# Altium project bms_mainboard-1_0.PrjPcb (part 2 of 7)

## Sheet mcu_stm32f4.SchDoc
size D; SheetNumber: 2
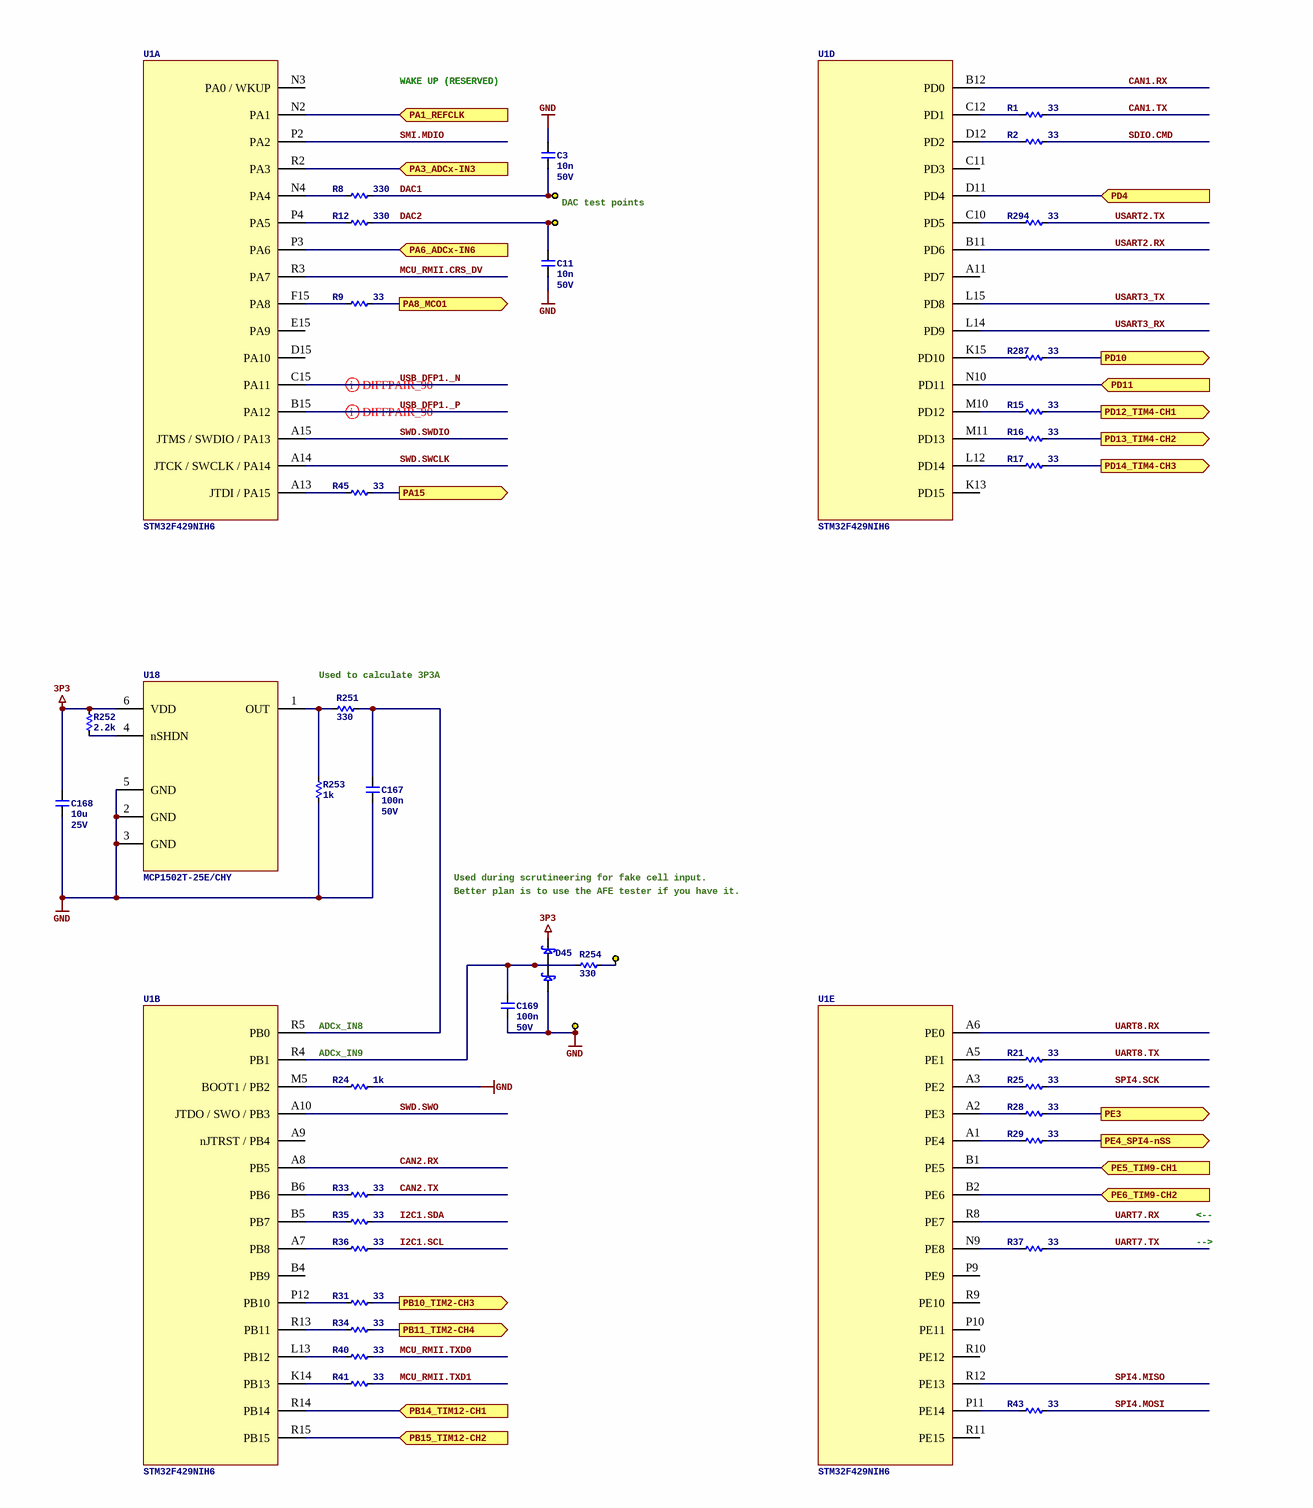
[diagram p4: mcu_stm32f4.SchDoc, top left]
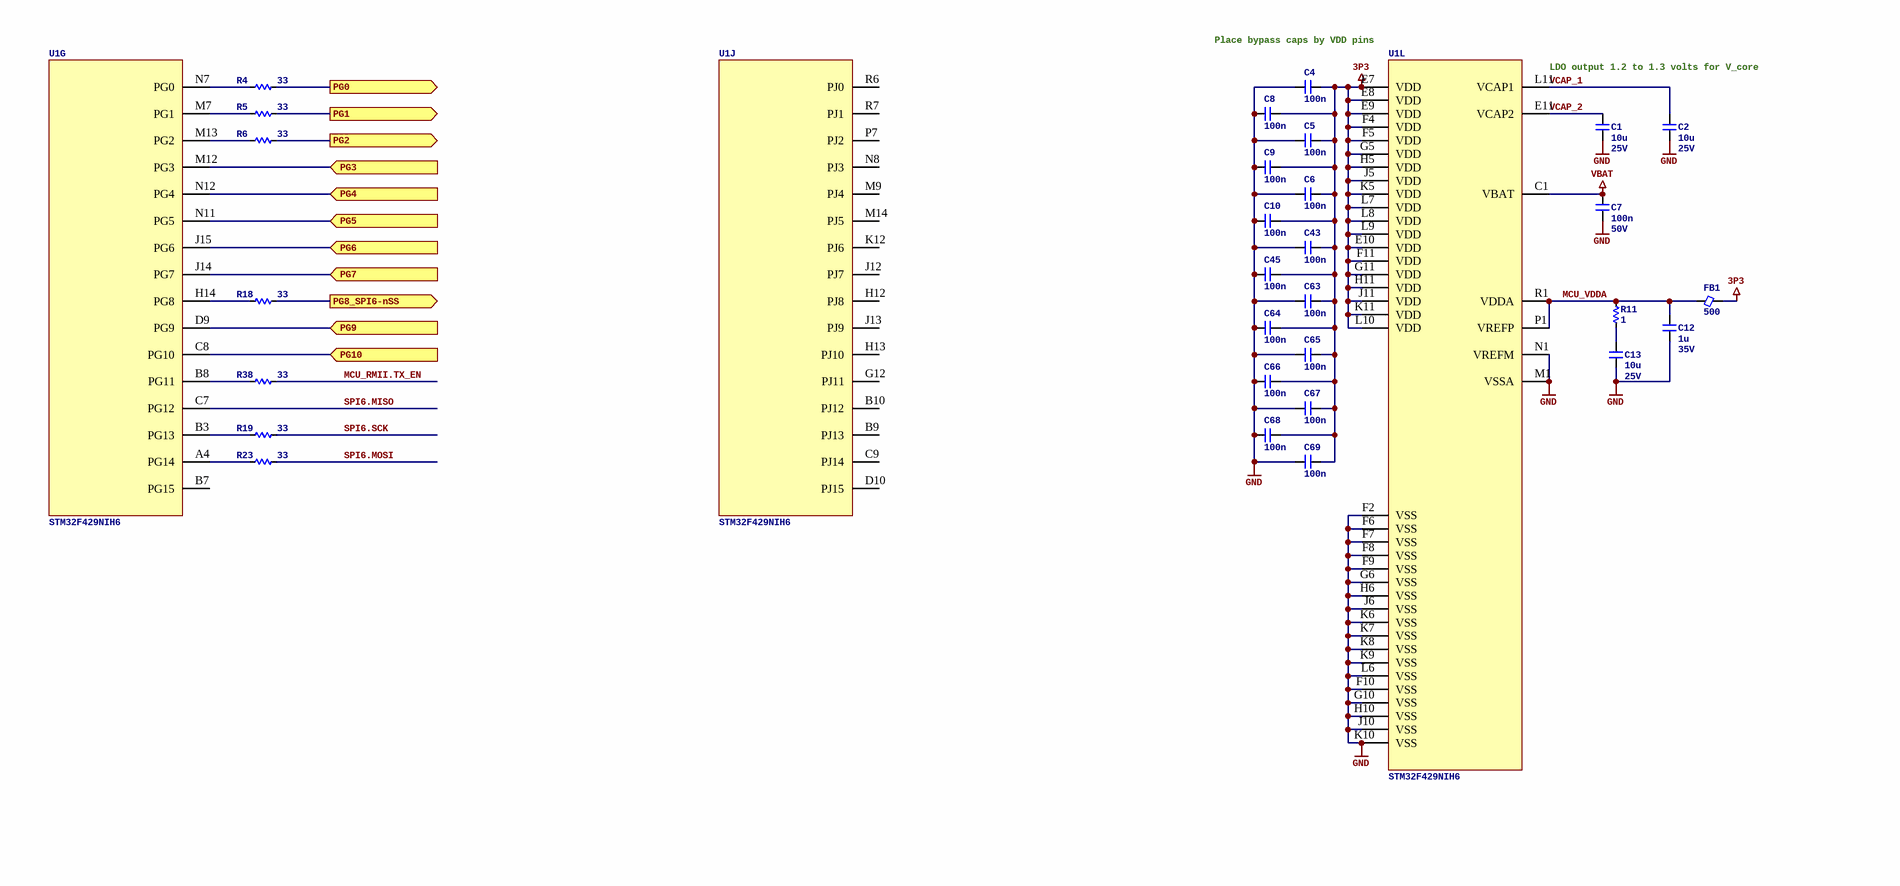
[diagram p5: mcu_stm32f4.SchDoc, top right]
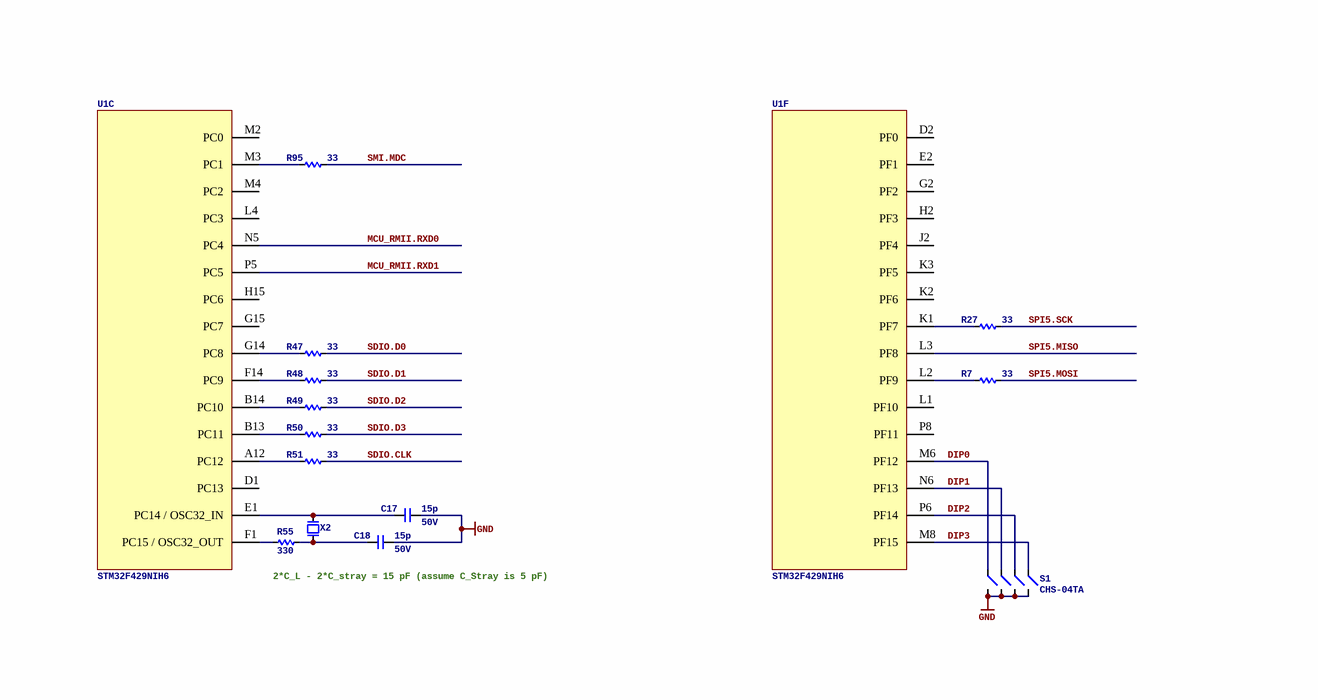
[diagram p6: mcu_stm32f4.SchDoc, bottom left]
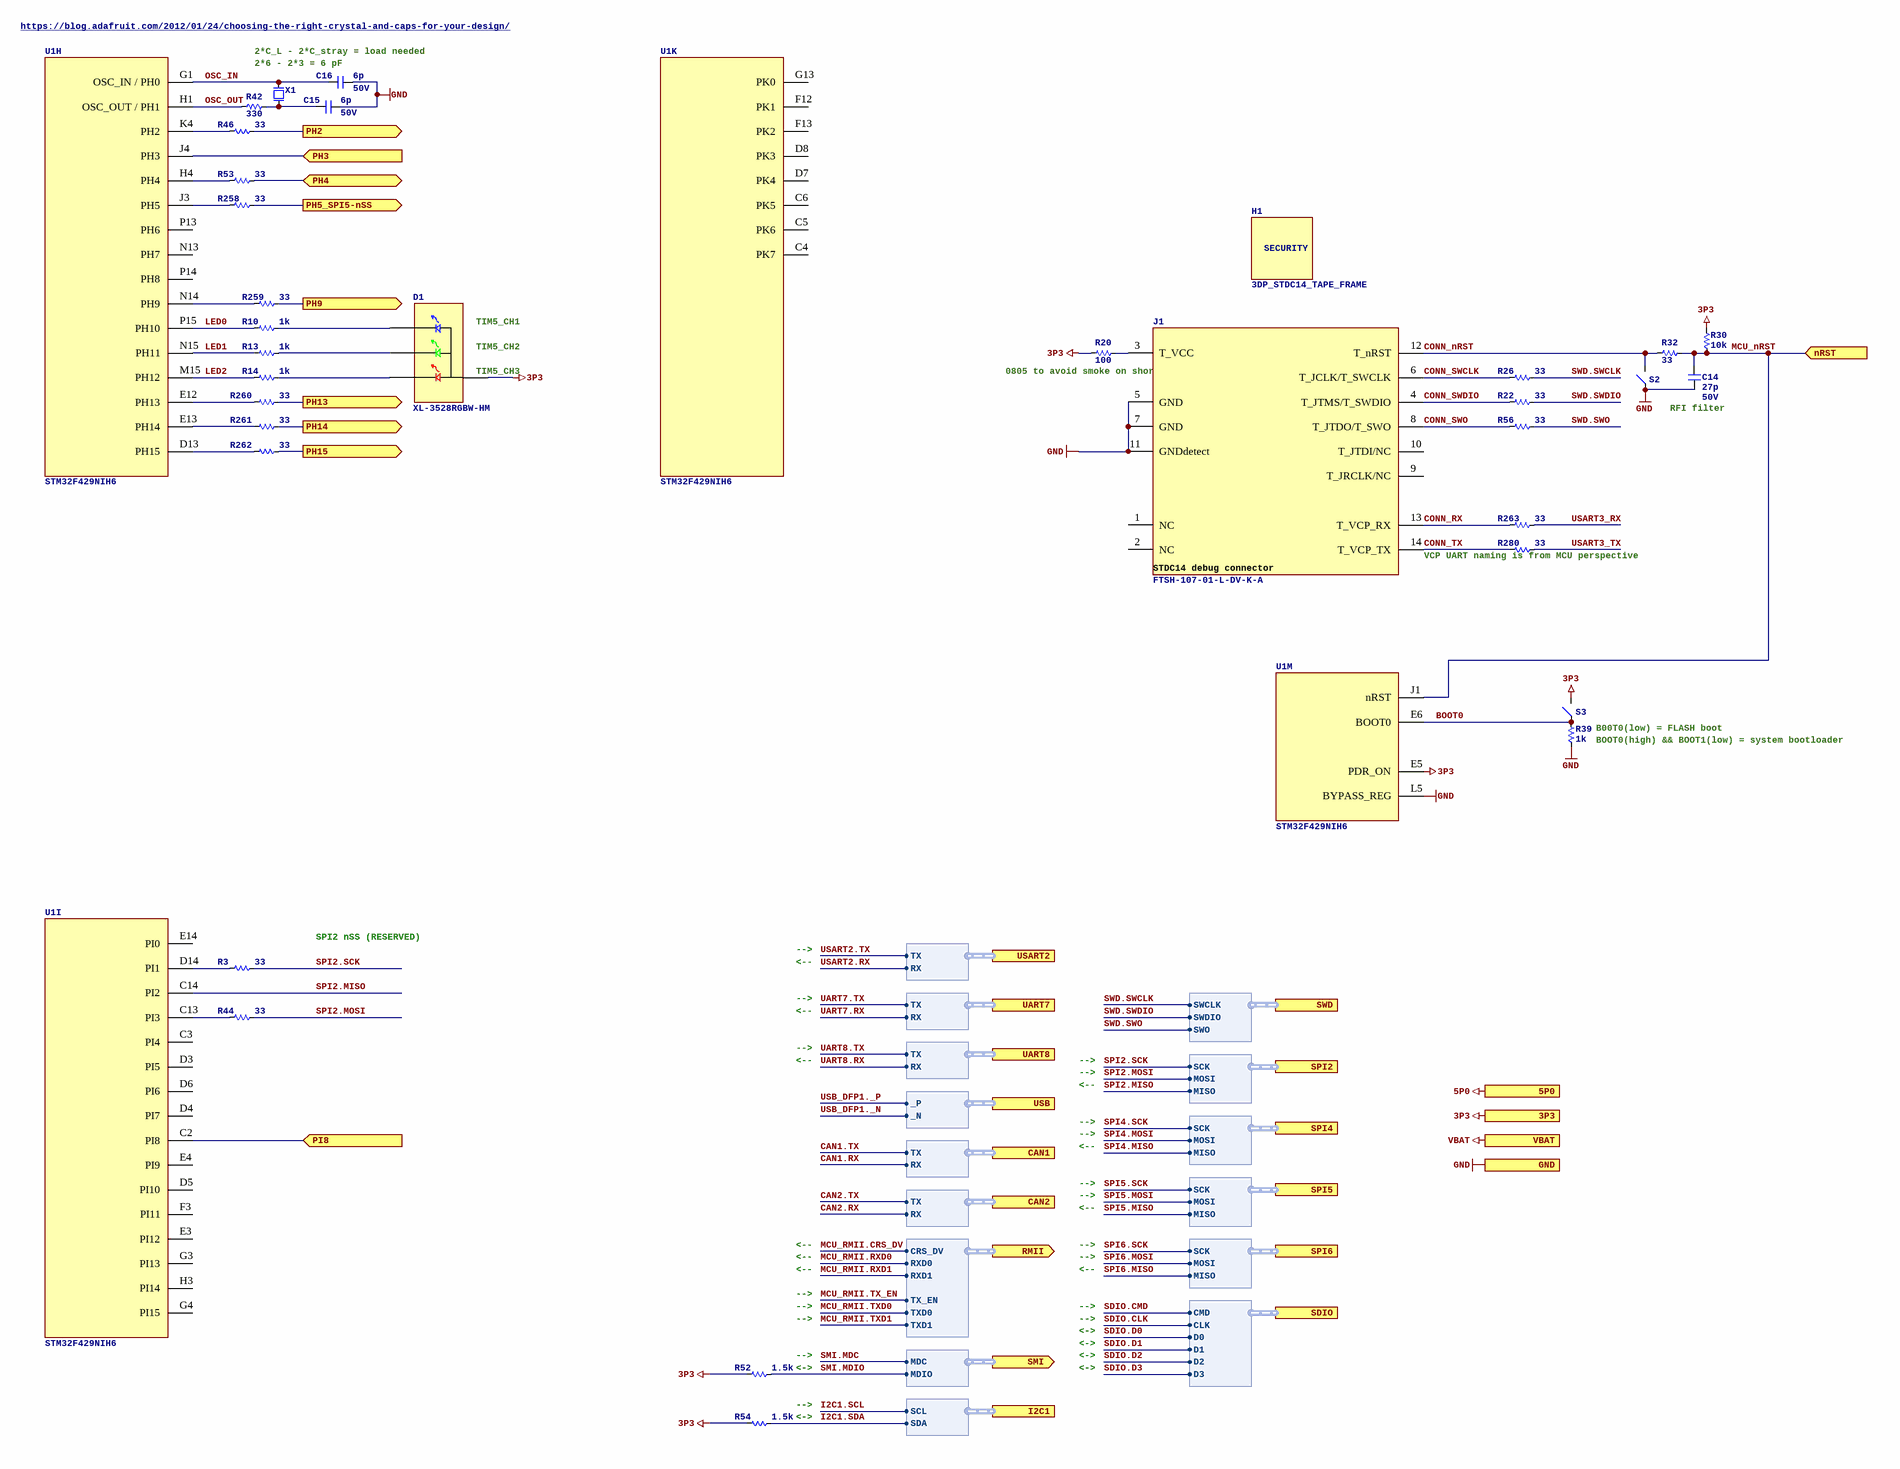
[diagram p7: mcu_stm32f4.SchDoc, bottom right]

### Parts
C1  Capacitance: 10u  Voltage Rating: 25V  [C0603]  (hidden comment: CL10A106MA8NRNC)
C2  Capacitance: 10u  Voltage Rating: 25V  [C0603]  (hidden comment: CL10A106MA8NRNC)
C3  Capacitance: 10n  Voltage Rating: 50V  [C0402]  (hidden comment: CL05B103KB5NNNC)
C4  Capacitance: 100n  [C0402]  (hidden comment: CL05B104KB54PNC)
C5  Capacitance: 100n  [C0402]  (hidden comment: CL05B104KB54PNC)
C6  Capacitance: 100n  [C0402]  (hidden comment: CL05B104KB54PNC)
C7  Capacitance: 100n  Voltage Rating: 50V  [C0402]  (hidden comment: CL05B104KB54PNC)
C8  Capacitance: 100n  [C0402]  (hidden comment: CL05B104KB54PNC)
C9  Capacitance: 100n  [C0402]  (hidden comment: CL05B104KB54PNC)
C10  Capacitance: 100n  [C0402]  (hidden comment: CL05B104KB54PNC)
C11  Capacitance: 10n  Voltage Rating: 50V  [C0402]  (hidden comment: CL05B103KB5NNNC)
C12  Capacitance: 1u  Voltage Rating: 35V  [C0603]  (hidden comment: GMK107AB7105KAHT)
C13  Capacitance: 10u  Voltage Rating: 25V  [C0805]  (hidden comment: CL21B106KAYQNNE)
C14  Capacitance: 27p  Voltage Rating: 50V  [C0402]  (hidden comment: 0402CG270J500NT)
C15  Capacitance: 6p  Voltage Rating: 50V  [C0402]  (hidden comment: 0402CG6R0C500NT)
C16  Capacitance: 6p  Voltage Rating: 50V  [C0402]  (hidden comment: 0402CG6R0C500NT)
C17  Capacitance: 15p  Voltage Rating: 50V  [C0402]  (hidden comment: 0402CG150J500NT)
C18  Capacitance: 15p  Voltage Rating: 50V  [C0402]  (hidden comment: 0402CG150J500NT)
C43  Capacitance: 100n  [C0402]  (hidden comment: CL05B104KB54PNC)
C45  Capacitance: 100n  [C0402]  (hidden comment: CL05B104KB54PNC)
C63  Capacitance: 100n  [C0402]  (hidden comment: CL05B104KB54PNC)
C64  Capacitance: 100n  [C0402]  (hidden comment: CL05B104KB54PNC)
C65  Capacitance: 100n  [C0402]  (hidden comment: CL05B104KB54PNC)
C66  Capacitance: 100n  [C0402]  (hidden comment: CL05B104KB54PNC)
C67  Capacitance: 100n  [C0402]  (hidden comment: CL05B104KB54PNC)
C68  Capacitance: 100n  [C0402]  (hidden comment: CL05B104KB54PNC)
C69  Capacitance: 100n  [C0402]  (hidden comment: CL05B104KB54PNC)
C167  Capacitance: 100n  Voltage Rating: 50V  [C0402]  (hidden comment: CL05B104KB54PNC)
C168  Capacitance: 10u  Voltage Rating: 25V  [C0603]  (hidden comment: CL10A106MA8NRNC)
C169  Capacitance: 100n  Voltage Rating: 50V  [C0402]  (hidden comment: CL05B104KB54PNC)
D1  XL-3528RGBW-HM  [LED_RGB_SMD3528-4P]
D45  BAT54SLT1G  [3SOT23]  (value not drawn)
FB1  Current Rating (mA): 500  [FB0402]  (hidden comment: BLM15AX601SN1D)
H1  3DP_STDC14_TAPE_FRAME  [3DP_STDC14_TAPE_FRAME]
J1  FTSH-107-01-L-DV-K-A  [SAMTEC_FTSH-107-01-L-DV-K-A]
R1  value 33  [R0402]  (hidden comment: 0402WGF330JTCE)
R2  value 33  [R0402]  (hidden comment: 0402WGF330JTCE)
R3  value 33  [R0402]  (hidden comment: 0402WGF330JTCE)
R4  value 33  [R0402]  (hidden comment: 0402WGF330JTCE)
R5  value 33  [R0402]  (hidden comment: 0402WGF330JTCE)
R6  value 33  [R0402]  (hidden comment: 0402WGF330JTCE)
R7  value 33  [R0402]  (hidden comment: 0402WGF330JTCE)
R8  value 330  [R0402]  (hidden comment: 0402WGF3300TCE)
R9  value 33  [R0402]  (hidden comment: 0402WGF330JTCE)
R10  value 1k  [R0402]  (hidden comment: 0402WGF1001TCE)
R11  value 1  [R0402]  (hidden comment: CRCW04021R00FKED)
R12  value 330  [R0402]  (hidden comment: 0402WGF3300TCE)
R13  value 1k  [R0402]  (hidden comment: 0402WGF1001TCE)
R14  value 1k  [R0402]  (hidden comment: 0402WGF1001TCE)
R15  value 33  [R0402]  (hidden comment: 0402WGF330JTCE)
R16  value 33  [R0402]  (hidden comment: 0402WGF330JTCE)
R17  value 33  [R0402]  (hidden comment: 0402WGF330JTCE)
R18  value 33  [R0402]  (hidden comment: 0402WGF330JTCE)
R19  value 33  [R0402]  (hidden comment: 0402WGF330JTCE)
R20  value 100  [R0805]  (hidden comment: ERJP06F1000V)
R21  value 33  [R0402]  (hidden comment: 0402WGF330JTCE)
R22  value 33  [R0402]  (hidden comment: 0402WGF330JTCE)
R23  value 33  [R0402]  (hidden comment: 0402WGF330JTCE)
R24  value 1k  [R0402]  (hidden comment: 0402WGF1001TCE)
R25  value 33  [R0402]  (hidden comment: 0402WGF330JTCE)
R26  value 33  [R0402]  (hidden comment: 0402WGF330JTCE)
R27  value 33  [R0402]  (hidden comment: 0402WGF330JTCE)
R28  value 33  [R0402]  (hidden comment: 0402WGF330JTCE)
R29  value 33  [R0402]  (hidden comment: 0402WGF330JTCE)
R30  value 10k  [R0402]  (hidden comment: 0402WGF1002TCE)
R31  value 33  [R0402]  (hidden comment: 0402WGF330JTCE)
R32  value 33  [R0402]  (hidden comment: 0402WGF330JTCE)
R33  value 33  [R0402]  (hidden comment: 0402WGF330JTCE)
R34  value 33  [R0402]  (hidden comment: 0402WGF330JTCE)
R35  value 33  [R0402]  (hidden comment: 0402WGF330JTCE)
R36  value 33  [R0402]  (hidden comment: 0402WGF330JTCE)
R37  value 33  [R0402]  (hidden comment: 0402WGF330JTCE)
R38  value 33  [R0402]  (hidden comment: 0402WGF330JTCE)
R39  value 1k  [R0402]  (hidden comment: 0402WGF1001TCE)
R40  value 33  [R0402]  (hidden comment: 0402WGF330JTCE)
R41  value 33  [R0402]  (hidden comment: 0402WGF330JTCE)
R42  value 330  [R0402]  (hidden comment: 0402WGF3300TCE)
R43  value 33  [R0402]  (hidden comment: 0402WGF330JTCE)
R44  value 33  [R0402]  (hidden comment: 0402WGF330JTCE)
R45  value 33  [R0402]  (hidden comment: 0402WGF330JTCE)
R46  value 33  [R0402]  (hidden comment: 0402WGF330JTCE)
R47  value 33  [R0402]  (hidden comment: 0402WGF330JTCE)
R48  value 33  [R0402]  (hidden comment: 0402WGF330JTCE)
R49  value 33  [R0402]  (hidden comment: 0402WGF330JTCE)
R50  value 33  [R0402]  (hidden comment: 0402WGF330JTCE)
R51  value 33  [R0402]  (hidden comment: 0402WGF330JTCE)
R52  value 1.5k  [R0402]  (hidden comment: 0402WGF1501TCE)
R53  value 33  [R0402]  (hidden comment: 0402WGF330JTCE)
R54  value 1.5k  [R0402]  (hidden comment: 0402WGF1501TCE)
R55  value 330  [R0402]  (hidden comment: 0402WGF3300TCE)
R56  value 33  [R0402]  (hidden comment: 0402WGF330JTCE)
R95  value 33  [R0402]  (hidden comment: 0402WGF330JTCE)
R251  value 330  [R0402]  (hidden comment: 0402WGF3300TCE)
R252  value 2.2k  [R0402]  (hidden comment: 0402WGF2201TCE)
R253  value 1k  [R0402]  (hidden comment: 0402WGF1001TCE)
R254  value 330  [R0402]  (hidden comment: 0402WGF3300TCE)
R258  value 33  [R0402]  (hidden comment: 0402WGF330JTCE)
R259  value 33  [R0402]  (hidden comment: 0402WGF330JTCE)
R260  value 33  [R0402]  (hidden comment: 0402WGF330JTCE)
R261  value 33  [R0402]  (hidden comment: 0402WGF330JTCE)
R262  value 33  [R0402]  (hidden comment: 0402WGF330JTCE)
R263  value 33  [R0402]  (hidden comment: 0402WGF330JTCE)
R280  value 33  [R0402]  (hidden comment: 0402WGF330JTCE)
R287  value 33  [R0402]  (hidden comment: 0402WGF330JTCE)
R294  value 33  [R0402]  (hidden comment: 0402WGF330JTCE)
S1  CHS-04TA  [SWITCH_NIDEC_CHS-04TA]
S2  TS-1092S-B3D2-G  [SWITCH_TS-1092S-B3D2-G]  (value not drawn)
S3  TS-1092S-B3D2-G  [SWITCH_TS-1092S-B3D2-G]  (value not drawn)
TP1  RH-5002  [TP_RH-5002]  (value not drawn)
TP2  RH-5002  [TP_RH-5002]  (value not drawn)
TP51  RH-5000  [TP_RH-5000]  (value not drawn)
TP52  RH-5001  [TP_RH-5001]  (value not drawn)
U1  STM32F429NIH6  [ST_TFBGA216]  (parts A,B,C,D,E,F,G,H,I,J,K,L,M of 13)
U18  MCP1502T-25E/CHY  [6SOT23]
X1  XTAL_XRCGB25M000F3A00R0  [4_SMD_2.0X1.6MM]  (value not drawn)
X2  XTAL_9HT10-32.768KEZF-T  [XTAL_TXC_9HT10]  (value not drawn)

### Ports
3P3, 5P0, CAN1 (harness CAN), CAN2 (harness CAN), GND, I2C1 (harness I2C), nRST (in), PA1_REFCLK (in), PA3_ADCx-IN3 (in), PA6_ADCx-IN6 (in), PA8_MCO1 (out), PA15 (out), PB10_TIM2-CH3 (out), PB11_TIM2-CH4 (out), PB14_TIM12-CH1 (in), PB15_TIM12-CH2 (in), PD4 (in), PD10 (out), PD11 (in), PD12_TIM4-CH1 (out), PD13_TIM4-CH2 (out), PD14_TIM4-CH3 (out), PE3 (out), PE4_SPI4-nSS (out), PE5_TIM9-CH1 (in), PE6_TIM9-CH2 (in), PG0 (out), PG1 (out), PG2 (out), PG3 (in), PG4 (in), PG5 (in), PG6 (in), PG7 (in), PG8_SPI6-nSS (out), PG9 (in), PG10 (in), PH2 (out), PH3 (in), PH4 (bidir), PH5_SPI5-nSS (out), PH9 (out), PH13 (out), PH14 (out), PH15 (out), PI8 (in), RMII (out, harness RMII), SDIO (harness SDIO), SMI (out, harness SMI), SPI2 (harness SPI), SPI4 (harness SPI), SPI5 (harness SPI), SPI6 (harness SPI), SWD (harness SWD), UART7 (harness UART), UART8 (harness UART), USART2 (harness UART), USB (harness DIFF), VBAT

### Harnesses
CAN: TX, RX
SDIO: CLK, CMD, D0, D1, D2, D3
SPI: MISO, MOSI, SCK
RMII: CRS_DV, RXD0, RXD1, TX_EN, TXD0, TXD1
SMI: MDC, MDIO
DIFF: _P, _N
SWD: SWCLK, SWDIO, SWO
UART: RX, TX
I2C: SCL, SDA

### Nets
3P3: C4.1 C5.1 C6.1 C8.1 C9.1 C10.1 C43.1 C45.1 C63.1 C64.1 C65.1 C66.1 C67.1 C68.1 C69.1 C168.1 D1.2 D45.2 FB1.2 R20.2 R30.1 R52.2 R54.2 R252.1 S3.2 U1.E5(PDR_ON) U1.E7(VDD) U1.E8(VDD) U1.E9(VDD) U1.E10(VDD) U1.F4(VDD) U1.F5(VDD) U1.F11(VDD) U1.G5(VDD) U1.G11(VDD) U1.H5(VDD) U1.H11(VDD) U1.J5(VDD) U1.J11(VDD) U1.K5(VDD) U1.K11(VDD) U1.L7(VDD) U1.L8(VDD) U1.L9(VDD) U1.L10(VDD) U18.6(VDD) ; port 3P3
GND: C1.2 C2.2 C3.2 C4.2 C5.2 C6.2 C7.2 C8.2 C9.2 C10.2 C11.2 C12.2 C13.2 C14.2 C15.2 C16.2 C17.2 C18.2 C43.2 C45.2 C63.2 C64.2 C65.2 C66.2 C67.2 C68.2 C69.2 C167.2 C168.2 C169.2 D45.1 J1.5(GND) J1.7(GND) J1.11(GNDdetect) R24.1 R39.2 R253.1 S1.2 S1.4 S1.6 S1.8 S2.1 TP52.1 U1.F2(VSS) U1.F6(VSS) U1.F7(VSS) U1.F8(VSS) U1.F9(VSS) U1.F10(VSS) U1.G6(VSS) U1.G10(VSS) U1.H6(VSS) U1.H10(VSS) U1.J6(VSS) U1.J10(VSS) U1.K6(VSS) U1.K7(VSS) U1.K8(VSS) U1.K9(VSS) U1.K10(VSS) U1.L5(BYPASS_REG) U1.L6(VSS) U1.M1(VSSA) U1.N1(VREFM) U18.2(GND) U18.3(GND) U18.5(GND) ; port GND
VBAT: C7.1 U1.C1(VBAT) ; port VBAT
AIN0: U1.R2(PA3) ; port PA3_ADCx-IN3
AIN1: U1.P3(PA6) ; port PA6_ADCx-IN6
BOOT0: R39.1 S3.1 U1.E6(BOOT0)  [project net BOOT0_2]
CAN1.RX: U1.B12(PD0) ; port CAN1.RX
CAN1.TX: R1.1 ; port CAN1.TX
CAN2.RX: U1.A8(PB5) ; port CAN2.RX
CAN2.TX: R33.1 ; port CAN2.TX
CONN_nRST: J1.12(T_nRST) R32.2 S2.2  [project net CONN_nRST_2]
CONN_RX: J1.13(T_VCP_RX) R263.2  [project net CONN_RX_2]
CONN_SWCLK: J1.6(T_JCLK/T_SWCLK) R26.2  [project net CONN_SWCLK_2]
CONN_SWDIO: J1.4(T_JTMS/T_SWDIO) R22.2  [project net CONN_SWDIO_2]
CONN_SWO: J1.8(T_JTDO/T_SWO) R56.2  [project net CONN_SWO_2]
CONN_TX: J1.14(T_VCP_TX) R280.2  [project net CONN_TX_2]
DAC1: C3.1 R8.2 TP1.1  [project net DAC1_2]
DAC2: C11.1 R12.2 TP2.1  [project net DAC2_2]
DIN0: U1.N12(PG4) ; port PG4
DIN1: U1.N11(PG5) ; port PG5
DIN2: U1.J14(PG7) ; port PG7
DIN3: U1.J15(PG6) ; port PG6
DIP0: S1.7 U1.M6(PF12)  [project net DIP0_2]
DIP1: S1.5 U1.N6(PF13)  [project net DIP1_2]
DIP2: S1.3 U1.P6(PF14)  [project net DIP2_2]
DIP3: S1.1 U1.M8(PF15)  [project net DIP3_2]
ETH_REFCLK: U1.N2(PA1) ; port PA1_REFCLK
ETH_SWITCH_nINT: U1.N10(PD11) ; port PD11
ETH_SWITCH_nRST: R287.1 ; port PD10
ETH_SWITCH_nSS3: R45.1 ; port PA15
ETH_SWITCH_SYNCLKO: U1.R15(PB15) ; port PB15_TIM12-CH2
FAN1_PWM: R31.1 ; port PB10_TIM2-CH3
FAN1_TACH: U1.B1(PE5) ; port PE5_TIM9-CH1
FAN2_PWM: R34.1 ; port PB11_TIM2-CH4
FAN2_TACH: U1.B2(PE6) ; port PE6_TIM9-CH2
GNSS_nRST: R259.1 ; port PH9
HS_CONTACTOR: R15.1 ; port PD12_TIM4-CH1
HV_BUCK_EN: R5.1 ; port PG1
HV_nBLEED: R4.1 ; port PG0
I2C1.SCL: R36.1 ; port I2C1.SCL
I2C1.SDA: R35.1 R54.1 ; port I2C1.SDA
IMU_INT1: U1.D9(PG9) ; port PG9
IMU_INT2: U1.C8(PG10) ; port PG10
LED0: R10.2 U1.P15(PH10)  [project net LED0_2]
LED1: R13.2 U1.N15(PH11)  [project net LED1_2]
LED2: R14.2 U1.M15(PH12)  [project net LED2_2]
LS_CONTACTOR: R16.1 ; port PD13_TIM4-CH2
LV_nSS0: R260.1 ; port PH13
LV_nSS1: R261.1 ; port PH14
LV_nSS2: R262.1 ; port PH15
LV_PWM_CLK: R9.1 ; port PA8_MCO1
MCP3913_nDR: U1.C2(PI8) ; port PI8
MCP3913_nRST: R28.1 ; port PE3
MCU_nRST: C14.1 R30.2 R32.1 U1.J1(nRST) ; port nRST
MCU_RMII.CRS_DV: U1.R3(PA7) ; port RMII.CRS_DV
MCU_RMII.RXD0: U1.N5(PC4) ; port RMII.RXD0
MCU_RMII.RXD1: U1.P5(PC5) ; port RMII.RXD1
MCU_RMII.TX_EN: R38.1 ; port RMII.TX_EN
MCU_RMII.TXD0: R40.1 ; port RMII.TXD0
MCU_RMII.TXD1: R41.1 ; port RMII.TXD1
MCU_VDDA: C12.1 FB1.1 R11.2 U1.P1(VREFP) U1.R1(VDDA)  [project net MCU_VDDA_2]
OSC_IN: C16.1 U1.G1(OSC_IN_/_PH0) X1.3  [project net OSC_IN_2]
OSC_OUT: R42.1 U1.H1(OSC_OUT_/_PH1)  [project net OSC_OUT_2]
PC_RELAY: R17.1 ; port PD14_TIM4-CH3
PHY_GPIO0: R53.1 ; port PH4
PHY_nIRQ: U1.J4(PH3) ; port PH3
PHY_nRESET: R46.1 ; port PH2
PMIC_EN_DETECT: U1.M12(PG3) ; port PG3
PMIC_FORCE_EN: R6.1 ; port PG2
SD_DETECT: U1.D11(PD4) ; port PD4
SDIO.CLK: R51.1 ; port SDIO.CLK
SDIO.CMD: R2.1 ; port SDIO.CMD
SDIO.D0: R47.1 ; port SDIO.D0
SDIO.D1: R48.1 ; port SDIO.D1
SDIO.D2: R49.1 ; port SDIO.D2
SDIO.D3: R50.1 ; port SDIO.D3
SMI.MDC: R95.1 ; port SMI.MDC
SMI.MDIO: R52.1 U1.P2(PA2) ; port SMI.MDIO
SPI2.MISO: U1.C14(PI2) ; port SPI2.MISO
SPI2.MOSI: R44.1 ; port SPI2.MOSI
SPI2.SCK: R3.1 ; port SPI2.SCK
SPI4.MISO: U1.R12(PE13) ; port SPI4.MISO
SPI4.MOSI: R43.1 ; port SPI4.MOSI
SPI4.SCK: R25.1 ; port SPI4.SCK
SPI4_nSS: R29.1 ; port PE4_SPI4-nSS
SPI5.MISO: U1.L3(PF8) ; port SPI5.MISO
SPI5.MOSI: R7.1 ; port SPI5.MOSI
SPI5.SCK: R27.1 ; port SPI5.SCK
SPI5_nSS: R258.1 ; port PH5_SPI5-nSS
SPI6.MISO: U1.C7(PG12) ; port SPI6.MISO
SPI6.MOSI: R23.1 ; port SPI6.MOSI
SPI6.SCK: R19.1 ; port SPI6.SCK
SPI6_nSS: R18.1 ; port PG8_SPI6-nSS
SWD.SWCLK: R26.1 U1.A14(JTCK_/_SWCLK_/_PA14) ; port SWD.SWCLK
SWD.SWDIO: R22.1 U1.A15(JTMS_/_SWDIO_/_PA13) ; port SWD.SWDIO
SWD.SWO: R56.1 U1.A10(JTDO_/_SWO_/_PB3) ; port SWD.SWO
TIMEPULSE: U1.R14(PB14) ; port PB14_TIM12-CH1
UART7.RX: U1.R8(PE7) ; port UART7.RX
UART7.TX: R37.1 ; port UART7.TX
UART8.RX: U1.A6(PE0) ; port UART8.RX
UART8.TX: R21.1 ; port UART8.TX
USART2.RX: U1.B11(PD6) ; port USART2.RX
USART2.TX: R294.1 ; port USART2.TX
USART3_RX: R263.1 U1.L14(PD9)  [project net USART3_RX_2]
USART3_TX: R280.1 U1.L15(PD8)  [project net USART3_TX_2]
USB_DFP1._N: U1.C15(PA11) ; port USB._N
USB_DFP1._P: U1.B15(PA12) ; port USB._P
VCAP_1: C2.1 U1.L11(VCAP1)  [project net VCAP_1_2]
VCAP_2: C1.1 U1.E11(VCAP2)  [project net VCAP_2_2]
NetC13_1: C13.1 R11.1
NetC15_1: C15.1 R42.2 X1.1
NetC17_1: C17.1 U1.E1(PC14_/_OSC32_IN) X2.2
NetC18_1: C18.1 R55.2 X2.1
NetC167_1: C167.1 R251.2 U1.R5(PB0)
NetC169_1: C169.1 D45.3 R254.1 U1.R4(PB1)
NetD1_1: D1.1 R14.1
NetD1_3: D1.3 R13.1
NetD1_4: D1.4 R10.1
NetJ1_3: J1.3(T_VCC) R20.1
NetR1_2: R1.2 U1.C12(PD1)
NetR2_2: R2.2 U1.D12(PD2)
NetR3_2: R3.2 U1.D14(PI1)
NetR4_2: R4.2 U1.N7(PG0)
NetR5_2: R5.2 U1.M7(PG1)
NetR6_2: R6.2 U1.M13(PG2)
NetR7_2: R7.2 U1.L2(PF9)
NetR8_1: R8.1 U1.N4(PA4)
NetR9_2: R9.2 U1.F15(PA8)
NetR12_1: R12.1 U1.P4(PA5)
NetR15_2: R15.2 U1.M10(PD12)
NetR16_2: R16.2 U1.M11(PD13)
NetR17_2: R17.2 U1.L12(PD14)
NetR18_2: R18.2 U1.H14(PG8)
NetR19_2: R19.2 U1.B3(PG13)
NetR21_2: R21.2 U1.A5(PE1)
NetR23_2: R23.2 U1.A4(PG14)
NetR24_2: R24.2 U1.M5(BOOT1_/_PB2)
NetR25_2: R25.2 U1.A3(PE2)
NetR27_2: R27.2 U1.K1(PF7)
NetR28_2: R28.2 U1.A2(PE3)
NetR29_2: R29.2 U1.A1(PE4)
NetR31_2: R31.2 U1.P12(PB10)
NetR33_2: R33.2 U1.B6(PB6)
NetR34_2: R34.2 U1.R13(PB11)
NetR35_2: R35.2 U1.B5(PB7)
NetR36_2: R36.2 U1.A7(PB8)
NetR37_2: R37.2 U1.N9(PE8)
NetR38_2: R38.2 U1.B8(PG11)
NetR40_2: R40.2 U1.L13(PB12)
NetR41_2: R41.2 U1.K14(PB13)
NetR43_2: R43.2 U1.P11(PE14)
NetR44_2: R44.2 U1.C13(PI3)
NetR45_2: R45.2 U1.A13(JTDI_/_PA15)
NetR46_2: R46.2 U1.K4(PH2)
NetR47_2: R47.2 U1.G14(PC8)
NetR48_2: R48.2 U1.F14(PC9)
NetR49_2: R49.2 U1.B14(PC10)
NetR50_2: R50.2 U1.B13(PC11)
NetR51_2: R51.2 U1.A12(PC12)
NetR53_2: R53.2 U1.H4(PH4)
NetR55_1: R55.1 U1.F1(PC15_/_OSC32_OUT)
NetR95_2: R95.2 U1.M3(PC1)
NetR251_1: R251.1 R253.2 U18.1(OUT)
NetR252_2: R252.2 U18.4(nSHDN)
NetR254_2: R254.2 TP51.1
NetR258_2: R258.2 U1.J3(PH5)
NetR259_2: R259.2 U1.N14(PH9)
NetR260_2: R260.2 U1.E12(PH13)
NetR261_2: R261.2 U1.E13(PH14)
NetR262_2: R262.2 U1.D13(PH15)
NetR287_2: R287.2 U1.K15(PD10)
NetR294_2: R294.2 U1.C10(PD5)

Not connected (* = marked no-connect by the designer): J1 1(NC) 2(NC) 9(T_JRCLK/NC) 10(T_JTDI/NC); U1 A9(nJTRST_/_PB4) A11(PD7) B4(PB9) B7(PG15) B9(PJ13) B10(PJ12) C3(PI4) C4(PK7) C5(PK6) C6(PK5) C9(PJ14) C11(PD3) D1(PC13) D2(PF0) D3(PI5) D4(PI7) D5(PI10) D6(PI6) D7(PK4) D8(PK3) D10(PJ15) D15(PA10) E2(PF1) E3(PI12) E4(PI9) E14(PI0) E15(PA9) F3(PI11) F12(PK1) F13(PK2) G2(PF2) G3(PI13) G4(PI15) G12(PJ11) G13(PK0) G15(PC7) H2(PF3) H3(PI14) H12(PJ8) H13(PJ10) H15(PC6) J2(PF4) J12(PJ7) J13(PJ9) K2(PF6) K3(PF5) K12(PJ6) K13(PD15) L1(PF10) L4(PC3) M2(PC0) M4(PC2) M9(PJ4) M14(PJ5) N3(PA0_/_WKUP) N8(PJ3) N13(PH7) P7(PJ2) P8(PF11) P9(PE9) P10(PE11) P13(PH6) P14(PH8) R6(PJ0) R7(PJ1) R9(PE10) R10(PE12) R11(PE15)

### Layout directives
differential pair; differential pair class DE_90: USB_DFP1._N, USB_DFP1._P

### Notes on the sheet
- WAKE UP (RESERVED)
- Place bypass caps by VDD pins
- (near U1) LDO output 1.2 to 1.3 volts for V_core
- (near TP1) DAC test points
- (near R251) Used to calculate 3P3A
- Used during scrutineering for fake cell input.
- Better plan is to use the AFE tester if you have it.
- ADCx_IN8
- https://blog.adafruit.com/2012/01/24/choosing-the-right-crystal-and-caps-for-your-design/
- 2*C_L - 2*C_stray = load needed
- 2*6 - 2*3 = 6 pF
- ADCx_IN9
- <--
- -->
- (near D1) TIM5_CH1
- (near D1) TIM5_CH2
- (near D1) TIM5_CH3
- 0805 to avoid smoke on short
- RFI filter
- (near R280) VCP UART naming is from MCU perspective
- B00T0(low) = FLASH boot
- BOOT0(high) && BOOT1(low) = system bootloader
- SPI2 nSS (RESERVED)
- 2*C_L - 2*C_stray = 15 pF (assume C_Stray is 5 pF)
- (near R52) <->
- (near R52) -->
- <->
- (near R54) <->
- (in symbol 3DP_STDC14_TAPE_FRAME) SECURITY
- (in symbol CONN_14POS_50MIL_ST_CORTEX_DEBUG_VCP) STDC14 debug connector

### Library data of the parts
C1 C2 C168 = CL10A106MA8NRNC: Manufacturer: Samsung Electro-Mechanics; Dielectric: X5R; ComponentLink1URL: https://wmsc.lcsc.com/wmsc/upload/file/pdf/v2/lcsc/2304140030_Samsung-Electro-Mechanics-CL10A106MA8NRNC_C96446.pdf; ComponentLink1Description: Datasheet; Manufacturer Part Number: CL10A106MA8NRNC; Package: 0603; Supplier 2: LCSC; Supplier Part Number 2: C96446
C3 C11 = CL05B103KB5NNNC: Manufacturer: Samsung Electro-Mechanics; Dielectric: X7R; ComponentLink1URL: https://wmsc.lcsc.com/wmsc/upload/file/pdf/v2/lcsc/2304140030_Samsung-Electro-Mechanics-CL05B103KB5NNNC_C15195.pdf; ComponentLink1Description: Datasheet; Manufacturer Part Number: CL05B103KB5NNNC; Package: 0402; Supplier 2: LCSC; Supplier Part Number 2: C15195
C4-C6 C8-C10 C43 C45 C63-C69 = CL05B104KB54PNC: Manufacturer: Samsung Electro-Mechanics; Voltage Rating: 50V; Dielectric: X7R; ComponentLink1URL: https://wmsc.lcsc.com/wmsc/upload/file/pdf/v2/lcsc/2304140030_Samsung-Electro-Mechanics-CL05B104KB54PNC_C307331.pdf; ComponentLink1Description: Datasheet; Manufacturer Part Number: CL05B104KB54PNC; Package: 0402; Supplier 2: LCSC; Supplier Part Number 2: C307331
C7 C167 C169 = CL05B104KB54PNC: as C171 on sheet bridge_bq79600; ComponentLink1URL: https://wmsc.lcsc.com/wmsc/upload/file/pdf/v2/lcsc/2304140030_Samsung-Electro-Mechanics-CL05B104KB54PNC_C307331.pdf; ComponentLink1Description: Datasheet; Manufacturer Part Number: CL05B104KB54PNC; Package: 0402; Supplier 2: LCSC; Supplier Part Number 2: C307331
C12 = GMK107AB7105KAHT: Manufacturer: Taiyo Yuden; Dielectric: X7R; ComponentLink1URL: https://datasheet.lcsc.com/lcsc/2304140030_Taiyo-Yuden-GMK107AB7105KAHT_C841050.pdf; ComponentLink1Description: Datasheet; Manufacturer Part Number: GMK107AB7105KAHT; Package: 0603; Supplier 2: LCSC; Supplier Part Number 2: C841050
C13 = CL21B106KAYQNNE: Manufacturer: Samsung Electro-Mechanics; Dielectric: X7R; ComponentLink1URL: https://datasheet.lcsc.com/lcsc/2206222030_Samsung-Electro-Mechanics-CL21B106KAYQNNE_C3039694.pdf; ComponentLink1Description: Datasheet; Manufacturer Part Number: CL21B106KAYQNNE; Package: 0805; Supplier 2: LCSC; Supplier Part Number 2: C3039694
C14 = 0402CG270J500NT: Manufacturer: FH(Guangdong Fenghua Advanced Tech); Dielectric: C0G; ComponentLink1URL: https://wmsc.lcsc.com/wmsc/upload/file/pdf/v2/lcsc/2304140030_FH--Guangdong-Fenghua-Advanced-Tech-0402CG270J500NT_C1557.pdf; ComponentLink1Description: Datasheet; Manufacturer Part Number: 0402CG270J500NT; Package: 0402; Supplier 2: LCSC; Supplier Part Number 2: C1557
C15 C16 = 0402CG6R0C500NT: Manufacturer: FH(Guangdong Fenghua Advanced Tech); Dielectric: C0G; ComponentLink1URL: https://wmsc.lcsc.com/wmsc/upload/file/pdf/v2/lcsc/2304140030_FH--Guangdong-Fenghua-Advanced-Tech-0402CG6R0C500NT_C1575.pdf; ComponentLink1Description: Datasheet; Manufacturer Part Number: 0402CG6R0C500NT; Package: 0402; Supplier 2: LCSC; Supplier Part Number 2: C1575
C17 C18 = 0402CG150J500NT: Manufacturer: FH(Guangdong Fenghua Advanced Tech); Dielectric: C0G; ComponentLink1URL: https://wmsc.lcsc.com/wmsc/upload/file/pdf/v2/lcsc/2304140030_FH--Guangdong-Fenghua-Advanced-Tech-0402CG150J500NT_C1548.pdf; ComponentLink1Description: Datasheet; Manufacturer Part Number: 0402CG150J500NT; Package: 0402; Supplier 2: LCSC; Supplier Part Number 2: C1548
D1 = LED_RGB_XL-3528RGBW-HM: LED Multi-Color Chip Red/Green/Blue 621nm/525nm/468nm 25mA/15mA/15mA 4-Pin PLCC T/R; Manufacturer: XINGLIGHT; Supplier 1: Digikey; Supplier Part Number 1: 5962-XL-3528RGBW-HMTR-ND; Manufacturer Part Number: XL-3528RGBW-HM; ComponentLink1Description: Datasheet; ComponentLink1URL: https://mm.digikey.com/Volume0/opasdata/d220001/medias/docus/8903/XL-3528RGBW-HM.pdf; Supplier 2: LCSC; Supplier Part Number 2: C2843813
D45 = SCHOTTKY_30V_DUAL_BAT54SLT1G: DIODE SCHOTTKY DUAL 30V SOT23; Manufacturer: ON Semiconductor; Supplier 1: Digikey; Manufacturer Part Number: BAT54SLT1G; RoHS: RoHS Compliant; ComponentLink1URL: https://www.onsemi.com/pdf/datasheet/bat54slt1-d.pdf; ComponentLink1Description: Datasheet; Supplier Part Number 1: BAT54SLT1GOSCT-ND; Supplier 2: LCSC; Supplier Part Number 2: C19726
FB1 = BLM15AX601SN1D: Manufacturer: Murata Electronics; Z @ 100 MHz: 600; DCR (mOhms): 340; ComponentLink1URL: https://wmsc.lcsc.com/wmsc/upload/file/pdf/v2/lcsc/2304140030_Murata-Electronics-BLM15AX601SN1D_C76886.pdf; ComponentLink1Description: Datasheet; Manufacturer Part Number: BLM15AX601SN1D; Supplier 2: LCSC; Supplier Part Number 2: C76886; Package: 0402
H1 = 3DP_STDC14_TAPE_FRAME: 3D-printed plastic frame used for security tape around STDC14 programming header; Manufacturer: SSCP; Supplier 1: SSCP; Supplier Part Number 1: N/A; Manufacturer Part Number: N/A
J1 = CONN_14POS_50MIL_ST_CORTEX_DEBUG_VCP: Connector Header Surface Mount 14 position 0.050" (1.27mm); Manufacturer: Samtec; Supplier 1: Digikey; Supplier Part Number 1: FTSH-107-01-L-DV-K-A-ND; Manufacturer Part Number: FTSH-107-01-L-DV-K-A; ComponentLink2URL: https://mm.digikey.com/Volume0/opasdata/d220001/medias/docus/6209/ftsh-1xx-xx-xxx-dv-xxx-xxx-x-xx-mkt.pdf; ComponentLink2Description: Datasheet; Supplier 2: LCSC; Supplier Part Number 2: C5563894
R1-R7 R9 R15-R19 R21-R23 R25-R29 R31-R38 R40 R41 R43-R51 R53 R56 R95 R258-R263 R280 R287 R294 = 0402WGF330JTCE: as R290 on sheet bridge_bq79600; ComponentLink1Description: Datasheet; ComponentLink1URL: https://wmsc.lcsc.com/wmsc/upload/file/pdf/v2/lcsc/2205311900_UNI-ROYAL-Uniroyal-Elec-0402WGF330JTCE_C25105.pdf; Manufacturer Part Number: 0402WGF330JTCE; Package: 0402; Supplier 2: LCSC; Supplier Part Number 2: C25105
R8 R12 R42 R55 R251 R254 = 0402WGF3300TCE: Manufacturer: UNI-ROYAL(Uniroyal Elec); Tolerance: 1%; Temperature Coefficient: Â±100ppm/â„ƒ; Power Rating (mW): 62.5; ComponentLink1Description: Datasheet; ComponentLink1URL: https://wmsc.lcsc.com/wmsc/upload/file/pdf/v2/lcsc/2205311900_UNI-ROYAL-Uniroyal-Elec-0402WGF3300TCE_C25104.pdf; Manufacturer Part Number: 0402WGF3300TCE; Package: 0402; Supplier 2: LCSC; Supplier Part Number 2: C25104
R10 R13 R14 R24 R39 R253 = 0402WGF1001TCE: as R292 on sheet conn_isouart; ComponentLink1Description: Datasheet; ComponentLink1URL: https://wmsc.lcsc.com/wmsc/upload/file/pdf/v2/lcsc/2206010216_UNI-ROYAL-Uniroyal-Elec-0402WGF1001TCE_C11702.pdf; Manufacturer Part Number: 0402WGF1001TCE; Package: 0402; Supplier 2: LCSC; Supplier Part Number 2: C11702
R11 = CRCW04021R00FKED: Manufacturer: Vishay Intertech; Tolerance: 1%; Temperature Coefficient: Â±100ppm/â„ƒ; Power Rating (mW): 63; ComponentLink1Description: Datasheet; ComponentLink1URL: https://wmsc.lcsc.com/wmsc/upload/file/pdf/v2/lcsc/2211030200_Vishay-Intertech-CRCW04021R00FKED_C482087.pdf; Manufacturer Part Number: CRCW04021R00FKED; Package: 0402; Supplier 2: LCSC; Supplier Part Number 2: C482087
R20 = ERJP06F1000V: Manufacturer: PANASONIC; Tolerance: 1%; Temperature Coefficient: Â±100ppm/â„ƒ; Power Rating (mW): 500; ComponentLink1Description: Datasheet; ComponentLink1URL: https://wmsc.lcsc.com/wmsc/upload/file/pdf/v2/lcsc/2404150944_PANASONIC-ERJP06F1000V_C441975.pdf; Manufacturer Part Number: ERJP06F1000V; Package: 0805; Supplier 2: LCSC; Supplier Part Number 2: C441975
R30 = 0402WGF1002TCE: as R288 on sheet bridge_bq79600; ComponentLink1Description: Datasheet; ComponentLink1URL: https://wmsc.lcsc.com/wmsc/upload/file/pdf/v2/lcsc/2206010100_UNI-ROYAL-Uniroyal-Elec-0402WGF1002TCE_C25744.pdf; Manufacturer Part Number: 0402WGF1002TCE; Package: 0402; Supplier 2: LCSC; Supplier Part Number 2: C25744
R52 R54 = 0402WGF1501TCE: Manufacturer: UNI-ROYAL(Uniroyal Elec); Tolerance: 1%; Temperature Coefficient: Â±100ppm/â„ƒ; Power Rating (mW): 62.5; ComponentLink1Description: Datasheet; ComponentLink1URL: https://wmsc.lcsc.com/wmsc/upload/file/pdf/v2/lcsc/2206010045_UNI-ROYAL-Uniroyal-Elec-0402WGF1501TCE_C25867.pdf; Manufacturer Part Number: 0402WGF1501TCE; Package: 0402; Supplier 2: LCSC; Supplier Part Number 2: C25867
R252 = 0402WGF2201TCE: Manufacturer: UNI-ROYAL(Uniroyal Elec); Tolerance: 1%; Temperature Coefficient: Â±100ppm/â„ƒ; Power Rating (mW): 62.5; ComponentLink1Description: Datasheet; ComponentLink1URL: https://wmsc.lcsc.com/wmsc/upload/file/pdf/v2/lcsc/2206010045_UNI-ROYAL-Uniroyal-Elec-0402WGF2201TCE_C25879.pdf; Manufacturer Part Number: 0402WGF2201TCE; Package: 0402; Supplier 2: LCSC; Supplier Part Number 2: C25879
S1 = SWITCH_CHS-04TA: DIP Switch, Slide, SPST, Flush, Recessed, 6VDC, 100mA, CHS Series | Nidec Components CHS-04TA; Manufacturer: Nidec Copal; Supplier 1: Digikey; Supplier Part Number 1: 563-1007-1-ND; Manufacturer Part Number: CHS-04TA; Supplier 2: LCSC; Supplier Part Number 2: C2921610; ComponentLink1Description: Datasheet; ComponentLink1URL: https://www.nidec-components.com/e/catalog/switch/chs.pdf
S2 S3 = SWITCH_TS-1092S-B3D2-G: SWITCH TACTILE SPST-NO; Manufacturer: Yuandi; Supplier 1: LCSC; Supplier Part Number 1: C520860; Manufacturer Part Number: TS-1092S-B3D2-G; ComponentLink1Description: Datasheet; ComponentLink1URL: https://www.lcsc.com/datasheet/lcsc_datasheet_2005071437_Yuandi-TS-1092S-B3D2-G_C520860.pdf
TP1 TP2 = RH-5002: Manufacturer: ronghe; ComponentLink1Description: Datasheet; ComponentLink1URL: https://datasheet.lcsc.com/lcsc/2307040929_ronghe-RH-5000_C5277086.pdf; Manufacturer Part Number: RH-5002; Supplier 2: LCSC; Supplier Part Number 2: C5199802
TP51 = RH-5000: Manufacturer: ronghe; ComponentLink1Description: Datasheet; ComponentLink1URL: https://datasheet.lcsc.com/lcsc/2307040929_ronghe-RH-5000_C5277086.pdf; Manufacturer Part Number: RH-5000; Supplier 2: LCSC; Supplier Part Number 2: C5277086
TP52 = RH-5001: Manufacturer: ronghe; ComponentLink1Description: Datasheet; ComponentLink1URL: https://datasheet.lcsc.com/lcsc/2307040929_ronghe-RH-5000_C5277086.pdf; Manufacturer Part Number: RH-5001; Supplier 2: LCSC; Supplier Part Number 2: C5199801
U1 = MCU_STM32F429NIH6: ARM® Cortex®-M4 STM32F4 Microcontroller IC 32-Bit 180MHz 2MB (2M x 8) FLASH 216-TFBGA (13x13); Manufacturer: STMicroelectronics; ComponentLink1Description: Datasheet; ComponentLink1URL: https://www.st.com/content/ccc/resource/technical/document/datasheet/03/b4/b2/36/4c/72/49/29/DM00071990.pdf/files/DM00071990.pdf/jcr:content/translations/en.DM00071990.pdf; ComponentLink2Description: Reference Manual; ComponentLink2URL: https://www.st.com/resource/en/reference_manual/rm0090-stm32f405415-stm32f407417-stm32f427437-and-stm32f429439-advanced-armbased-32bit-mcus-stmicroelectronics.pdf; Manufacturer Part Number: STM32F429NIH6; Supplier 1: Digikey; Supplier Part Number 1: 497-17457-ND; Supplier 2: LCSC; Supplier Part Number 2: C710318
U18 = REF_2.5V_MCP1502T-25E/CHY: IC 7 PPM 0.1% VOLTAGE REFERENCE Series Voltage Reference IC Fixed 2.5V V ±0.1% 20 mA SOT-23-6; Manufacturer: Microchip; Supplier 1: Digikey; Supplier Part Number 1: 150-MCP1502T-25E/CHYCT-ND; Manufacturer Part Number: MCP1502T-25E/CHY; Supplier 2: LCSC; Supplier Part Number 2: C3680051; ComponentLink1Description: Datasheet; ComponentLink1URL: https://ww1.microchip.com/downloads/aemDocuments/documents/MSLD/ProductDocuments/DataSheets/MCP1502-Data-Sheet-20006593B.pdf
X1 = XTAL_XRCGB25M000F3A00R0: CRYSTAL 25.000MHZ 6PF SMD; Manufacturer: Murata; Supplier 1: Digikey; Supplier Part Number 1: 490-12146-2-ND; Manufacturer Part Number: XRCGB25M000F3A00R0; Supplier 2: LCSC; Supplier Part Number 2: C467842; ComponentLink1Description: Datasheet; ComponentLink1URL: https://www.murata.com/products/productdata/8801076543518/SPEC-XRCGB25M000F3A00R0.pdf
X2 = XTAL_9HT10-32.768KEZF-T: CRYSTAL 32.768 KHZ 12.5 PF SMD; Manufacturer: TXC CORPORATION; Supplier 1: Digikey; Manufacturer Part Number: 9HT10-32.768KEZF-T; ComponentLink1URL: http://www.txccrystal.com/images/pdf/9ht10.pdf; ComponentLink1Description: Datasheet; Supplier Part Number 1: 887-1507-1-ND; Supplier 2: LCSC; Supplier Part Number 2: C5932452

## Sheet pmic_tps65263_buck.SchDoc
size B
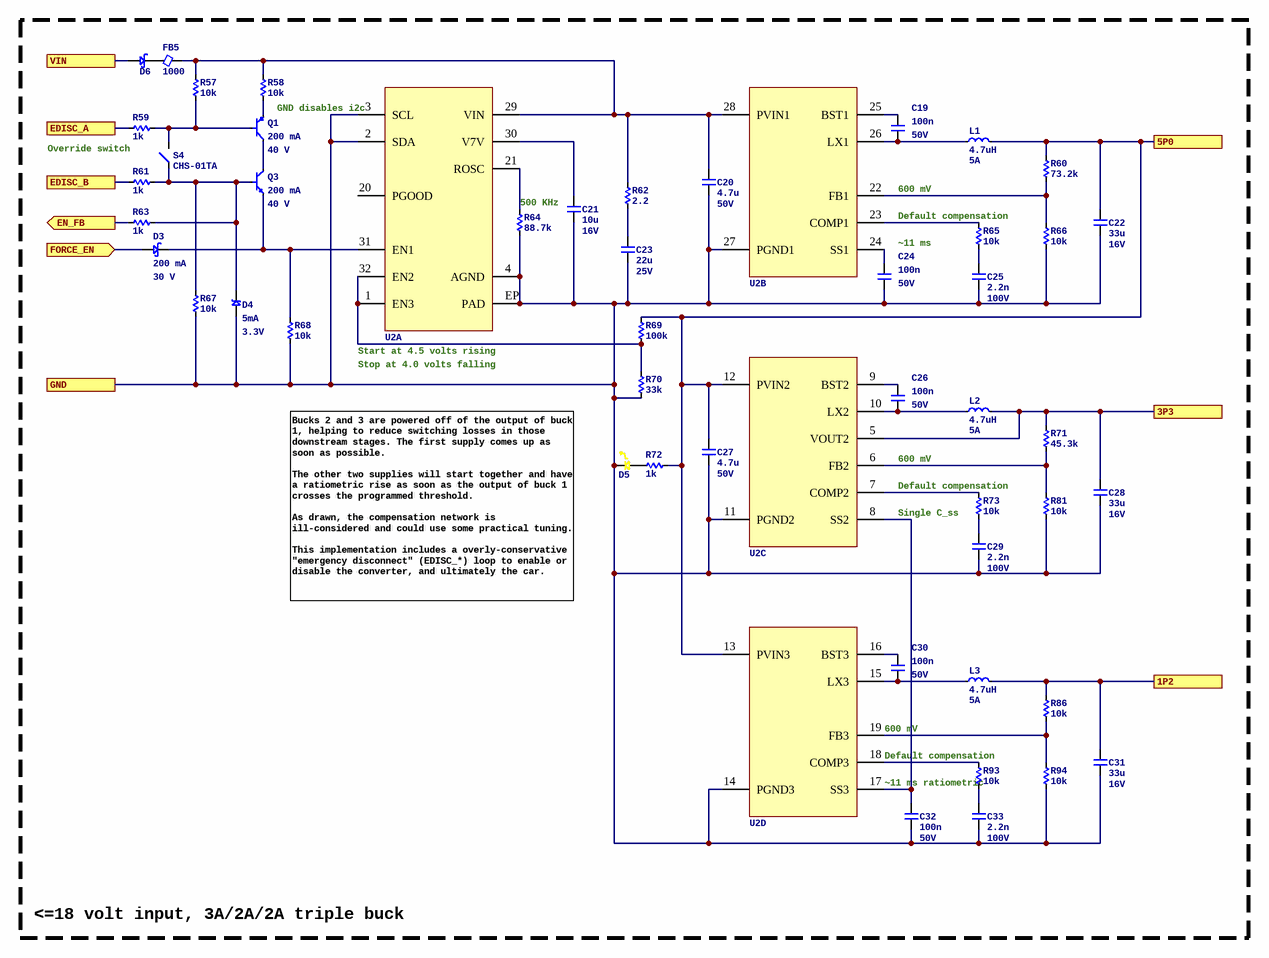
[diagram p8: pmic_tps65263_buck.SchDoc]

### Parts
C19  Capacitance: 100n  Voltage Rating: 50V  [C0402]  (hidden comment: CL05B104KB54PNC)
C20  Capacitance: 4.7u  Voltage Rating: 50V  [C0805]  (hidden comment: 0805B475K500NT)
C21  Capacitance: 10u  Voltage Rating: 16V  [C0805]  (hidden comment: CL21B106KOQNNNE)
C22  Capacitance: 33u  Voltage Rating: 16V  [C1812]  (hidden comment: C4532X7R1C336MT000N)
C23  Capacitance: 22u  Voltage Rating: 25V  [C2220]  (hidden comment: C5750X7R1E226MT000N)
C24  Capacitance: 100n  Voltage Rating: 50V  [C0402]  (hidden comment: CL05B104KB54PNC)
C25  Capacitance: 2.2n  Voltage Rating: 100V  [C0402]  (hidden comment: CC0402KRX7R0BB222)
C26  Capacitance: 100n  Voltage Rating: 50V  [C0402]  (hidden comment: CL05B104KB54PNC)
C27  Capacitance: 4.7u  Voltage Rating: 50V  [C0805]  (hidden comment: 0805B475K500NT)
C28  Capacitance: 33u  Voltage Rating: 16V  [C1812]  (hidden comment: C4532X7R1C336MT000N)
C29  Capacitance: 2.2n  Voltage Rating: 100V  [C0402]  (hidden comment: CC0402KRX7R0BB222)
C30  Capacitance: 100n  Voltage Rating: 50V  [C0402]  (hidden comment: CL05B104KB54PNC)
C31  Capacitance: 33u  Voltage Rating: 16V  [C1812]  (hidden comment: C4532X7R1C336MT000N)
C32  Capacitance: 100n  Voltage Rating: 50V  [C0402]  (hidden comment: CL05B104KB54PNC)
C33  Capacitance: 2.2n  Voltage Rating: 100V  [C0402]  (hidden comment: CC0402KRX7R0BB222)
D3  Current: 200 mA  Voltage: 30 V  [SOD523]  (hidden comment: BAT54XV2T1G)
D4  Current: 5mA  Voltage: 3.3V  [SOD523]  (hidden comment: SZMM5Z3V3T1G)
D5  LTST-C190YKT  [LED_0603P_YELLOW]  (value not drawn)
D6  B340A-13-F  [SMA]  (value not drawn)
FB5  Current Rating (mA): 1000  [FB0805]  (hidden comment: HCB2012KF-102T10)
L1  value 4.7uH  Current: 5A  [SMD-4.1x4.1x2.0]  (hidden comment: FTC404020S4R7MGCA)
L2  value 4.7uH  Current: 5A  [SMD-4.1x4.1x2.0]  (hidden comment: FTC404020S4R7MGCA)
L3  value 4.7uH  Current: 5A  [SMD-4.1x4.1x2.0]  (hidden comment: FTC404020S4R7MGCA)
Q1  Current: 200 mA  Voltage: 40 V  [3SOT523]  (hidden comment: MMBT3906T)
Q3  Current: 200 mA  Voltage: 40 V  [3SOT523]  (hidden comment: MMBT3904T)
R57  value 10k  [R0402]  (hidden comment: 0402WGF1002TCE)
R58  value 10k  [R0402]  (hidden comment: 0402WGF1002TCE)
R59  value 1k  [R0402]  (hidden comment: 0402WGF1001TCE)
R60  value 73.2k  [R0402]  (hidden comment: 0402WGF7322TCE)
R61  value 1k  [R0402]  (hidden comment: 0402WGF1001TCE)
R62  value 2.2  [R0805]  (hidden comment: HP05W3F220KT5E)
R63  value 1k  [R0402]  (hidden comment: 0402WGF1001TCE)
R64  value 88.7k  [R0402]  (hidden comment: 0402WGF8872TCE)
R65  value 10k  [R0402]  (hidden comment: 0402WGF1002TCE)
R66  value 10k  [R0402]  (hidden comment: 0402WGF1002TCE)
R67  value 10k  [R0402]  (hidden comment: 0402WGF1002TCE)
R68  value 10k  [R0402]  (hidden comment: 0402WGF1002TCE)
R69  value 100k  [R0402]  (hidden comment: 0402WGF1003TCE)
R70  value 33k  [R0402]  (hidden comment: 0402WGF3302TCE)
R71  value 45.3k  [R0402]  (hidden comment: FRC0402F4532TS)
R72  value 1k  [R0402]  (hidden comment: 0402WGF1001TCE)
R73  value 10k  [R0402]  (hidden comment: 0402WGF1002TCE)
R81  value 10k  [R0402]  (hidden comment: 0402WGF1002TCE)
R86  value 10k  [R0402]  (hidden comment: 0402WGF1002TCE)
R93  value 10k  [R0402]  (hidden comment: 0402WGF1002TCE)
R94  value 10k  [R0402]  (hidden comment: 0402WGF1002TCE)
S4  CHS-01TA  [SWITCH_NIDEC_CHS-01TA]
U2  TPS65263QRHBRQ1  [TI_RHB]  (value not drawn)  (parts A,B,C,D of 4)

### Ports
1P2, 3P3, 5P0, EDISC_A, EDISC_B, EN_FB (out), FORCE_EN (in), GND, VIN

### Nets
1P2: C31.1 L3.2 R86.2 ; port 1P2
3P3: C28.1 L2.2 R71.2 U2.5(VOUT2) ; port 3P3
5P0: C22.1 C27.1 L1.2 R60.2 R69.2 R72.2 U2.12(PVIN2) U2.13(PVIN3) ; port 5P0
GND: C20.2 C21.2 C22.2 C23.2 C24.2 C25.2 C27.2 C28.2 C29.2 C31.2 C32.2 C33.2 D4.1 D5.1 R64.1 R66.1 R67.1 R68.1 R70.1 R81.1 R94.1 U2.2(SDA) U2.3(SCL) U2.4(AGND) U2.11(PGND2) U2.14(PGND3) U2.27(PGND1) U2.EP(PAD) ; port GND
LVB: D6.1 ; port VIN
EDISC_A: R59.1 ; port EDISC_A
EDISC_B: R61.1 ; port EDISC_B
PMIC_EN_DETECT: R63.1 ; port EN_FB
PMIC_FORCE_EN: D3.1 ; port FORCE_EN
NetC19_1: C19.1 U2.25(BST1)
NetC19_2: C19.2 L1.1 U2.26(LX1)
NetC20_1: C20.1 FB5.2 R57.2 R58.2 R62.2 U2.28(PVIN1) U2.29(VIN)
NetC21_1: C21.1 U2.30(V7V)
NetC23_1: C23.1 R62.1
NetC24_1: C24.1 U2.24(SS1)
NetC25_1: C25.1 R65.1
NetC26_1: C26.1 U2.9(BST2)
NetC26_2: C26.2 L2.1 U2.10(LX2)
NetC29_1: C29.1 R73.1
NetC30_1: C30.1 U2.16(BST3)
NetC30_2: C30.2 L3.1 U2.15(LX3)
NetC32_1: C32.1 U2.8(SS2) U2.17(SS3)
NetC33_1: C33.1 R93.1
NetD3_2: D3.2 Q3.2(E) R68.2 U2.31(EN1)
NetD4_2: D4.2 Q3.1(B) R61.2 R63.2 R67.2 S4.1
NetD5_2: D5.2 R72.1
NetD6_2: D6.2 FB5.1
NetQ1_1: Q1.1(B) R57.1 R59.2 S4.2
NetQ1_2: Q1.2(E) R58.1
NetQ1_3: Q1.3(C) Q3.3(C)
NetR60_1: R60.1 R66.2 U2.22(FB1)
NetR64_2: R64.2 U2.21(ROSC)
NetR65_2: R65.2 U2.23(COMP1)
NetR69_1: R69.1 R70.2 U2.1(EN3) U2.32(EN2)
NetR71_1: R71.1 R81.2 U2.6(FB2)
NetR73_2: R73.2 U2.7(COMP2)
NetR86_1: R86.1 R94.2 U2.19(FB3)
NetR93_2: R93.2 U2.18(COMP3)

Not connected (* = marked no-connect by the designer): U2 20(PGOOD)

### Notes on the sheet
- Override switch
- GND disables i2c
- (near R64) 500 KHz
- 600 mV
- (near R65) Default compensation
- ~11 ms
- Start at 4.5 volts rising
- Stop at 4.0 volts falling
- (near R73) Default compensation
- Single C_ss
- Bucks 2 and 3 are powered off of the output of buck 1, helping to reduce switching losses in those downstream stages. The first supply comes up as soon as possible.
  The other two supplies will start together and have a ratiometric rise as soon as the output of buck 1 crosses the programmed threshold.
  As drawn, the compensation network is ill-considered and could use some practical tuning.
  This implementation includes a overly-conservative "emergency disconnect" (EDISC_*) loop to enable or disable the converter, and ultimately the car.
- (near U2) 600 mV
- (near R93) Default compensation
- (near R93) ~11 ms ratiometric
- <=18 volt input, 3A/2A/2A triple buck

### Library data of the parts
C19 C24 C26 C30 C32 = CL05B104KB54PNC: as C171 on sheet bridge_bq79600; ComponentLink1URL: https://wmsc.lcsc.com/wmsc/upload/file/pdf/v2/lcsc/2304140030_Samsung-Electro-Mechanics-CL05B104KB54PNC_C307331.pdf; ComponentLink1Description: Datasheet; Manufacturer Part Number: CL05B104KB54PNC; Package: 0402; Supplier 2: LCSC; Supplier Part Number 2: C307331
C20 C27 = 0805B475K500NT: Manufacturer: FH (Guangdong Fenghua Advanced Tech); Dielectric: X7R; ComponentLink1URL: https://wmsc.lcsc.com/wmsc/upload/file/pdf/v2/lcsc/2204111630_FH--Guangdong-Fenghua-Advanced-Tech-0805B475K500NT_C2991173.pdf; ComponentLink1Description: Datasheet; Manufacturer Part Number: 0805B475K500NT; Package: 0805; Supplier 2: LCSC; Supplier Part Number 2: C2991173
C21 = CL21B106KOQNNNE: Manufacturer: Samsung Electro-Mechanics; Dielectric: X7R; ComponentLink1URL: https://wmsc.lcsc.com/wmsc/upload/file/pdf/v2/lcsc/2304140030_Samsung-Electro-Mechanics-CL21B106KOQNNNE_C95841.pdf; ComponentLink1Description: Datasheet; Manufacturer Part Number: CL21B106KOQNNNE; Package: 0805; Supplier 2: LCSC; Supplier Part Number 2: C95841
C22 C28 C31 = C4532X7R1C336MT000N: Manufacturer: TDK; Dielectric: X7R; ComponentLink1URL: https://wmsc.lcsc.com/wmsc/upload/file/pdf/v2/lcsc/2304140030_TDK-C4532X7R1C336MT000N_C342604.pdf; ComponentLink1Description: Datasheet; Manufacturer Part Number: C4532X7R1C336MT000N; Package: 1812; Supplier 2: LCSC; Supplier Part Number 2: C342604
C23 = C5750X7R1E226MT000N: Manufacturer: TDK; Dielectric: X7R; ComponentLink1URL: https://wmsc.lcsc.com/wmsc/upload/file/pdf/v2/lcsc/2409291207_TDK-C5750X7R1E226MT000N_C76694.pdf; ComponentLink1Description: Datasheet; Manufacturer Part Number: C5750X7R1E226MT000N; Package: 2220; Supplier 2: LCSC; Supplier Part Number 2: C76694
C25 C29 C33 = CC0402KRX7R0BB222: Manufacturer: YAGEO; Dielectric: X7R; ComponentLink1URL: https://wmsc.lcsc.com/wmsc/upload/file/pdf/v2/lcsc/2211211800_YAGEO-CC0402KRX7R0BB222_C576731.pdf; ComponentLink1Description: Datasheet; Manufacturer Part Number: CC0402KRX7R0BB222; Package: 0402; Supplier 2: LCSC; Supplier Part Number 2: C576731
D3 = SCHOTTKY_30V_BAT54XV2T1G: ON Semi BAT54XV2T1G; SMT Schottky Diode; 30V 200mA; 5ns; 2-Pin SOD-523; Manufacturer: onsemi; Supplier 1: DigiKey; Supplier Part Number 1: BAT54XV2T1GOSCT-ND; Manufacturer Part Number: BAT54XV2T1G; Supplier 2: LCSC; Supplier Part Number 2: C81572
D4 = ZENER_3.3V_SZMM5Z3V3T1G: 500 mW Standard Tolerance Zener Diode Voltage Regulators 3.3 V (Automotive); Manufacturer: onsemi; Supplier 1: DigiKey; Supplier Part Number 1: SZMM5Z3V3T1GOSCT-ND; Manufacturer Part Number: SZMM5Z3V3T1G; ComponentLink1Description: Datasheet; ComponentLink1URL: https://www.onsemi.com/pdf/datasheet/mm5z2v4t1-d.pdf; Supplier 2: LCSC; Supplier Part Number 2: C464127
D5 = LED_0603_YELLOW_LTST-C190YKT: LED YELLOW CLEAR 0603 SMD; Manufacturer: Lite-On Inc; Supplier 1: Digikey; ComponentLink1URL: https://mm.digikey.com/Volume0/opasdata/d220001/medias/docus/1176/LTST-C190YKT.pdf; ComponentLink1Description: Datasheet; Supplier Part Number 1: 160-1184-1-ND; Manufacturer Part Number: LTST-C190YKT; Supplier 2: LCSC; Supplier Part Number 2: C125097
D6 = SCHOTTKY_B340A-13-F: Rectifier Diode, Schottky, 1 Phase, 1 Element, 3A, 40V V(RRM), Silicon; Manufacturer: Diodes; Supplier 1: Digikey; ComponentLink1URL: https://www.diodes.com/assets/Datasheets/ds30891.pdf; Supplier Part Number 1: B340A-FDICT-ND; ComponentLink1Description: Datasheet; Manufacturer Part Number: B340A-13-F; Supplier 2: LCSC; Supplier Part Number 2: C85098
FB5 = HCB2012KF-102T10: Manufacturer: TAI-TECH; DCR (mOhms): 200; ComponentLink1URL: https://wmsc.lcsc.com/wmsc/upload/file/pdf/v2/lcsc/2009171138_TAI-TECH-HCB2012KF-102T10_C356985.pdf; ComponentLink1Description: Datasheet; Manufacturer Part Number: HCB2012KF-102T10; Package: 0805; Z @ 100 MHz: 1000; Supplier 2: LCSC; Supplier Part Number 2: C356985
L1-L3 = IND_4.7UH_FTC404020S4R7MGCA: 5A 4.7uH 6.3A 58mΩ ±20% SMD,4.1x4.1mm Fixed Inductors RoHS; Manufacturer: cjiang; ComponentLink1URL: https://www.lcsc.com/datasheet/C39676072.pdf; ComponentLink1Description: Datasheet; Manufacturer Part Number: FTC404020S4R7MGCA; Supplier 2: LCSC; Supplier Part Number 2: C39676072
Q1 = PNP_40V_MMBT3906T: Bipolar (BJT) Transistor NPN 40 V 200 mA 300MHz 150 mW Surface Mount SOT-523; Manufacturer: Shenzhen Slkormicro Semicon Co., Ltd.; Supplier 1: Digikey; Supplier Part Number 1: 5399-MMBT3906TCT-ND; Manufacturer Part Number: MMBT3906T; Supplier 2: LCSC; Supplier Part Number 2: C61615; ComponentLink1Description: Datasheet; ComponentLink1URL: https://mm.digikey.com/Volume0/opasdata/d220001/medias/docus/7136/5399_MMBT3906T%20SOT-523.pdf
Q3 = NPN_40V_MMBT3904T: Bipolar (BJT) Transistor NPN 40 V 200 mA 300MHz 150 mW Surface Mount SOT-523; Manufacturer: Shenzhen Slkormicro Semicon Co., Ltd.; Supplier 1: Digikey; Supplier Part Number 1: 5399-MMBT3904TCT-ND; Manufacturer Part Number: MMBT3904T; ComponentLink1Description: Datasheet; ComponentLink1URL: https://mm.digikey.com/Volume0/opasdata/d220001/medias/docus/7136/5399_MMBT3904T%20SOT-523.pdf; Supplier 2: LCSC; Supplier Part Number 2: C61616
R57 R58 R65-R68 R73 R81 R86 R93 R94 = 0402WGF1002TCE: as R288 on sheet bridge_bq79600; ComponentLink1Description: Datasheet; ComponentLink1URL: https://wmsc.lcsc.com/wmsc/upload/file/pdf/v2/lcsc/2206010100_UNI-ROYAL-Uniroyal-Elec-0402WGF1002TCE_C25744.pdf; Manufacturer Part Number: 0402WGF1002TCE; Package: 0402; Supplier 2: LCSC; Supplier Part Number 2: C25744
R59 R61 R63 R72 = 0402WGF1001TCE: as R292 on sheet conn_isouart; ComponentLink1Description: Datasheet; ComponentLink1URL: https://wmsc.lcsc.com/wmsc/upload/file/pdf/v2/lcsc/2206010216_UNI-ROYAL-Uniroyal-Elec-0402WGF1001TCE_C11702.pdf; Manufacturer Part Number: 0402WGF1001TCE; Package: 0402; Supplier 2: LCSC; Supplier Part Number 2: C11702
R60 = 0402WGF7322TCE: Manufacturer: UNI-ROYAL(Uniroyal Elec); Tolerance: 1%; Temperature Coefficient: Â±100ppm/â„ƒ; Power Rating (mW): 62.5; ComponentLink1Description: Datasheet; ComponentLink1URL: https://wmsc.lcsc.com/wmsc/upload/file/pdf/v2/lcsc/2206010030_UNI-ROYAL-Uniroyal-Elec-0402WGF7322TCE_C26986.pdf; Manufacturer Part Number: 0402WGF7322TCE; Package: 0402; Supplier 2: LCSC; Supplier Part Number 2: C26986
R62 = HP05W3F220KT5E: Manufacturer: UNI-ROYAL(Uniroyal Elec); Tolerance: 1%; Temperature Coefficient: Â±100ppm/â„ƒ; Power Rating (mW): 333.3; ComponentLink1Description: Datasheet; ComponentLink1URL: https://datasheet.lcsc.com/lcsc/2304140030_UNI-ROYAL-Uniroyal-Elec-HP05W3F220KT5E_C2759317.pdf; Manufacturer Part Number: HP05W3F220KT5E; Package: 0805; Supplier 2: LCSC; Supplier Part Number 2: C2759317
R64 = 0402WGF8872TCE: Manufacturer: UNI-ROYAL(Uniroyal Elec); Tolerance: 1%; Temperature Coefficient: Â±100ppm/â„ƒ; Power Rating (mW): 62.5; ComponentLink1Description: Datasheet; ComponentLink1URL: https://wmsc.lcsc.com/wmsc/upload/file/pdf/v2/lcsc/2206010045_UNI-ROYAL-Uniroyal-Elec-0402WGF8872TCE_C25922.pdf; Manufacturer Part Number: 0402WGF8872TCE; Package: 0402; Supplier 2: LCSC; Supplier Part Number 2: C25922
R69 = 0402WGF1003TCE: Manufacturer: UNI-ROYAL(Uniroyal Elec); Tolerance: 1%; Temperature Coefficient: Â±100ppm/â„ƒ; Power Rating (mW): 62.5; ComponentLink1Description: Datasheet; ComponentLink1URL: https://wmsc.lcsc.com/wmsc/upload/file/pdf/v2/lcsc/2206010100_UNI-ROYAL-Uniroyal-Elec-0402WGF1003TCE_C25741.pdf; Manufacturer Part Number: 0402WGF1003TCE; Package: 0402; Supplier 2: LCSC; Supplier Part Number 2: C25741
R70 = 0402WGF3302TCE: Manufacturer: UNI-ROYAL(Uniroyal Elec); Tolerance: 1%; Temperature Coefficient: Â±100ppm/â„ƒ; Power Rating (mW): 62.5; ComponentLink1Description: Datasheet; ComponentLink1URL: https://wmsc.lcsc.com/wmsc/upload/file/pdf/v2/lcsc/2206010100_UNI-ROYAL-Uniroyal-Elec-0402WGF3302TCE_C25779.pdf; Manufacturer Part Number: 0402WGF3302TCE; Package: 0402; Supplier 2: LCSC; Supplier Part Number 2: C25779
R71 = FRC0402F4532TS: Manufacturer: FOJAN; Tolerance: 1%; Temperature Coefficient: Â±100ppm/â„ƒ; Power Rating (mW): 62.5; ComponentLink1Description: Datasheet; ComponentLink1URL: https://datasheet.lcsc.com/lcsc/2308241947_FOJAN-FRC0402F4532TS_C2933099.pdf; Manufacturer Part Number: FRC0402F4532TS; Package: 0402; Supplier 2: LCSC; Supplier Part Number 2: C2933099
S4 = SWITCH_CHS-01TA: DIP Switch, Slide, SPST, Flush, Recessed, 6VDC, 100mA, CHS Series | Nidec Components CHS-01TA; Manufacturer: Nidec Copal; Supplier 1: Digikey; Supplier Part Number 1: 563-1003-1-ND; Manufacturer Part Number: CHS-01TA; ComponentLink1Description: Datasheet; ComponentLink1URL: https://www.nidec-components.com/e/catalog/switch/chs.pdf; Supplier 2: LCSC; Supplier Part Number 2: C2921603
U2 = BUCK_TPS65263QRHBRQ1: Switching Regulator, Current-mode, 3A, 2300kHz Switching Freq-Max, PQCC32; Manufacturer: Texas Instruments; ComponentLink4URL: https://www.ti.com/lit/ds/symlink/tps65263-q1.pdf; ComponentLink4Description: Datasheet; Supplier 1: Digikey; Supplier Part Number 1: 296-40886-1-ND; Supplier 2: LCSC; Supplier Part Number 2: C2073290; Manufacturer Part Number: TPS65263QRHBRQ1